# Altium schematic sheet Pixels.SchDoc
size A4
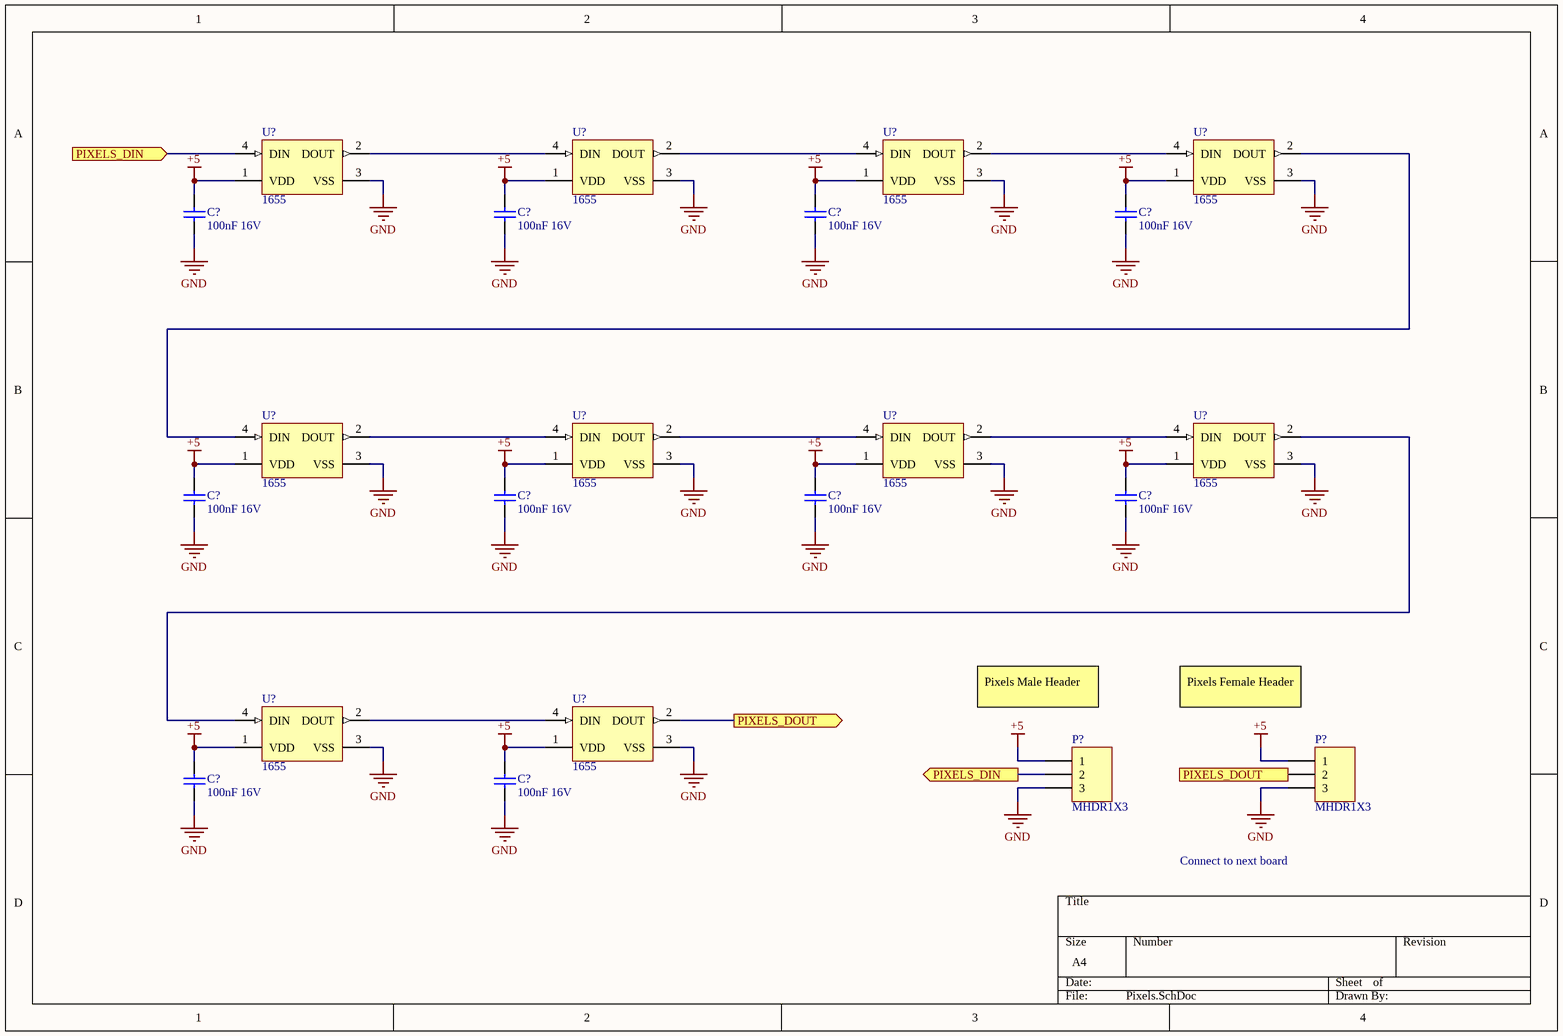
[diagram p0: Pixels.SchDoc]

## Parts
(Parts that share a designator on the sheet are numbered #1, #2 ... from top to bottom, then left to right.)
C?#1  100nF 16V  [CAPC0603(1608)100_N]
C?#2  100nF 16V  [CAPC0603(1608)100_N]
C?#3  100nF 16V  [CAPC0603(1608)100_N]
C?#4  100nF 16V  [CAPC0603(1608)100_N]
C?#5  100nF 16V  [CAPC0603(1608)100_N]
C?#6  100nF 16V  [CAPC0603(1608)100_N]
C?#7  100nF 16V  [CAPC0603(1608)100_N]
C?#8  100nF 16V  [CAPC0603(1608)100_N]
C?#9  100nF 16V  [CAPC0603(1608)100_N]
C?#10  100nF 16V  [CAPC0603(1608)100_N]
P?#1  MHDR1X3  [MHDR1X3]
P?#2  MHDR1X3  [MHDR1X3]
U?#1  1655  [ADA-RGB-1655_V]
U?#2  1655  [ADA-RGB-1655_V]
U?#3  1655  [ADA-RGB-1655_V]
U?#4  1655  [ADA-RGB-1655_V]
U?#5  1655  [ADA-RGB-1655_V]
U?#6  1655  [ADA-RGB-1655_V]
U?#7  1655  [ADA-RGB-1655_V]
U?#8  1655  [ADA-RGB-1655_V]
U?#9  1655  [ADA-RGB-1655_V]
U?#10  1655  [ADA-RGB-1655_V]

## Ports
PIXELS_DIN (in), PIXELS_DIN (out), PIXELS_DOUT (in), PIXELS_DOUT (out)

## Nets
+5: C?#1.2 C?#2.2 C?#3.2 C?#4.2 C?#5.2 C?#6.2 C?#7.2 C?#8.2 C?#9.2 C?#10.2 P?#1.1 P?#2.1 U?#1.1(VDD) U?#2.1(VDD) U?#3.1(VDD) U?#4.1(VDD) U?#5.1(VDD) U?#6.1(VDD) U?#7.1(VDD) U?#8.1(VDD) U?#9.1(VDD) U?#10.1(VDD)
GND: C?#1.1 C?#2.1 C?#3.1 C?#4.1 C?#5.1 C?#6.1 C?#7.1 C?#8.1 C?#9.1 C?#10.1 P?#1.3 P?#2.3 U?#1.3(VSS) U?#2.3(VSS) U?#3.3(VSS) U?#4.3(VSS) U?#5.3(VSS) U?#6.3(VSS) U?#7.3(VSS) U?#8.3(VSS) U?#9.3(VSS) U?#10.3(VSS)
PIXELS_DIN: P?#1.2 U?#1.4(DIN) ; port PIXELS_DIN
PIXELS_DOUT: P?#2.2 U?#10.2(DOUT) ; port PIXELS_DOUT
NetU?#1_2: U?#1.2(DOUT) U?#2.4(DIN)
NetU?#2_2: U?#2.2(DOUT) U?#3.4(DIN)
NetU?#3_2: U?#3.2(DOUT) U?#4.4(DIN)
NetU?#4_2: U?#4.2(DOUT) U?#5.4(DIN)
NetU?#5_2: U?#5.2(DOUT) U?#6.4(DIN)
NetU?#6_2: U?#6.2(DOUT) U?#7.4(DIN)
NetU?#7_2: U?#7.2(DOUT) U?#8.4(DIN)
NetU?#8_2: U?#8.2(DOUT) U?#9.4(DIN)
NetU?#9_2: U?#9.2(DOUT) U?#10.4(DIN)

## Notes on the sheet
- Pixels Male Header
- Pixels Female Header
- Connect to next board

## Library data of the parts
C?#1-C?#10 = CMP-1035-02584-1: CAP 100nF 16V ±10% 0603 (1608 Metric) Thickness 1mm SMD; Tolerance: Â±10%; Case-EIA: 0603; Case-Metric: 1608; Technology: SMT; Max Thickness: 1 mm; Value: 100nF; Rated Voltage: 16 V
P?#1 P?#2 = MHDR1X3: Header, 3-Pin; LatestRevisionDate: 17-Jul-2002; LatestRevisionNote: Re-released for DXP Platform.; Publisher: Altium Limited
U?#1-U?#10 = CMP-2000-05026-1: Intelligent Control LED Integrated Light Source, 3.5 to 5.3 V, -25 to 80 degC, 4-Pin SMD, RoHS, Tape and Reel; Manufacturer: Adafruit-Industries-LLC; Number of LEDs: 10; Configuration: Discrete; Utilized LED: WS2812(5050); Datasheet URL: http://datasheet.octopart.com/ADA1655-Adafruit-Industries-datasheet-32028139.pdf; Series: Neopixel; Interface: -; Package Description: 4-Pin Surface Mount Device, Body 5 x 5 mm; Color: Red,Green,Blue(RGB); Category: Optoelectronics; Controller Type: -; Package Reference: 1655; Manufacturer URL: https://www.adafruit.com/; Mounting Type: SurfaceMount; Datasheet Version: May-13; Size / Dimension: 5.00mmLx5.00mmW; Family: Addressable,Specialty